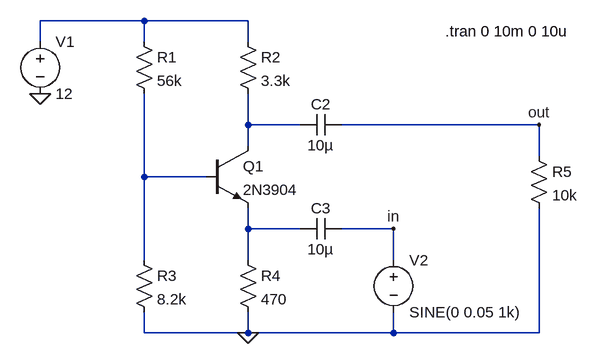
[diagram p0: schematic 4-cb.asc]
4-cb.asc, the LTspice schematic file:
Version 4.1
SHEET 1 880 680
WIRE 32 -64 -128 -64
WIRE 192 -64 32 -64
WIRE -128 -32 -128 -64
WIRE 32 -32 32 -64
WIRE 192 -32 192 -64
WIRE 192 96 192 48
WIRE 272 96 192 96
WIRE 640 96 336 96
WIRE 192 128 192 96
WIRE 640 144 640 96
WIRE 32 176 32 48
WIRE 128 176 32 176
WIRE 192 256 192 224
WIRE 272 256 192 256
WIRE 416 256 336 256
WIRE 32 304 32 176
WIRE 192 304 192 256
WIRE 416 304 416 256
WIRE 32 416 32 384
WIRE 192 416 192 384
WIRE 192 416 32 416
WIRE 416 416 416 384
WIRE 416 416 192 416
WIRE 640 416 640 224
WIRE 640 416 416 416
FLAG -128 48 0
FLAG 192 416 0
FLAG 640 96 out
FLAG 416 256 in
SYMBOL npn 128 128 R0
SYMATTR InstName Q1
SYMATTR Value 2N3904
SYMBOL cap 336 80 R90
WINDOW 0 0 32 VBottom 2
WINDOW 3 32 32 VTop 2
SYMATTR InstName C2
SYMATTR Value 10µ
SYMBOL voltage -128 -48 R0
SYMATTR InstName V1
SYMATTR Value 12
SYMBOL res 176 -48 R0
SYMATTR InstName R2
SYMATTR Value 3.3k
SYMBOL res 176 288 R0
SYMATTR InstName R4
SYMATTR Value 470
SYMBOL res 16 288 R0
SYMATTR InstName R3
SYMATTR Value 8.2k
SYMBOL res 16 -48 R0
SYMATTR InstName R1
SYMATTR Value 56k
SYMBOL cap 336 240 R90
WINDOW 0 0 32 VBottom 2
WINDOW 3 32 32 VTop 2
SYMATTR InstName C3
SYMATTR Value 10µ
SYMBOL voltage 416 288 R0
WINDOW 123 0 0 Left 0
WINDOW 39 0 0 Left 0
SYMATTR InstName V2
SYMATTR Value SINE(0 0.05 1k)
SYMBOL res 624 128 R0
SYMATTR InstName R5
SYMATTR Value 10k
TEXT 496 -48 Left 2 !.tran 0 10m 0 10u

The netlist it stands for:
* 4-cb.asc
Q1 N002 N003 N004 0 2N3904
C2 out N002 10µ
V1 N001 0 12
R2 N001 N002 3.3k
R4 N004 0 470
R3 N003 0 8.2k
R1 N001 N003 56k
C3 in N004 10µ
V2 in 0 SINE(0 0.05 1k)
R5 out 0 10k
.model NPN NPN
.model PNP PNP
.lib standard.bjt
.tran 0 10m 0 10u
.backanno
.end